# Altium schematic sheet AMU-S18-V00-CURRENTCurrentInterface.SchDoc: Current Sensor Circuity
size A3; DrawnBy: Jonn Dillon; DocumentNumber: 4; SheetNumber: 16; SheetTotal: 25; Project: Shutdown Current Board 2020
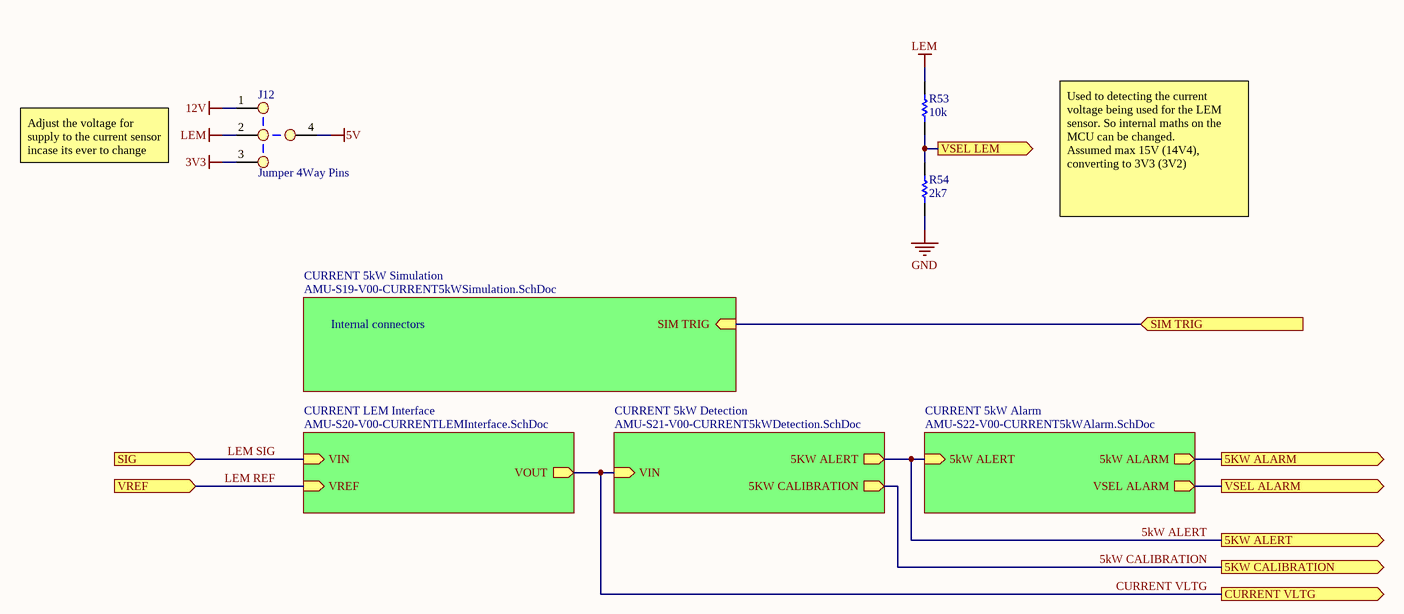
[diagram p0: AMU-S18-V00-CURRENTCurrentInterface.SchDoc]

## Parts
J12  Jumper 4Way Pins  [Jumper_4Way_Pin]
R53  10k  [Res_ThinFilm_0603]
R54  2k7  [Res_ThinFilm_0603]

## Sub-sheets
CURRENT 5kW Alarm = AMU-S22-V00-CURRENT5kWAlarm.SchDoc: 5kW ALARM (out), 5kW ALERT (in), VSEL ALARM (out)
CURRENT 5kW Detection = AMU-S21-V00-CURRENT5kWDetection.SchDoc: VIN (in), 5KW ALERT (out), 5KW CALIBRATION (out)
CURRENT 5kW Simulation = AMU-S19-V00-CURRENT5kWSimulation.SchDoc: SIM TRIG (in)
CURRENT LEM Interface = AMU-S20-V00-CURRENTLEMInterface.SchDoc: VOUT (out), VREF (in), VIN (in)

## Ports
5KW ALARM (out), 5KW ALERT (out), 5KW CALIBRATION (out), CURRENT VLTG (out), SIG (in), SIM TRIG (in), VREF (in), VSEL ALARM (out), VSEL LEM (out)

## Nets
3V3: J12.3
5V: J12.4
12V: J12.1
GND: R54.1
LEM: J12.2 R53.2
5KW ALARM: port 5KW ALARM, sheet CURRENT 5kW Alarm/5kW ALARM
5kW ALERT: port 5KW ALERT, sheet CURRENT 5kW Detection/5KW ALERT, sheet CURRENT 5kW Alarm/5kW ALERT
5kW CALIBRATION: port 5KW CALIBRATION, sheet CURRENT 5kW Detection/5KW CALIBRATION
CURRENT VLTG: port CURRENT VLTG, sheet CURRENT LEM Interface/VOUT, sheet CURRENT 5kW Detection/VIN
LEM REF: port VREF, sheet CURRENT LEM Interface/VREF
LEM SIG: port SIG, sheet CURRENT LEM Interface/VIN
SIM TRIG: port SIM TRIG, sheet CURRENT 5kW Simulation/SIM TRIG
VSEL ALARM: port VSEL ALARM, sheet CURRENT 5kW Alarm/VSEL ALARM
VSEL LEM: R53.1 R54.2 ; port VSEL LEM

## Notes on the sheet
- Adjust the voltage for supply to the current sensor incase its ever to change
- Used to detecting the current voltage being used for the LEM sensor. So internal maths on the MCU can be changed.
  Assumed max 15V (14V4), converting to 3V3 (3V2)
- Internal connectors
- Revision History:
- Sheet Title:
- Rev
- Date
- Description
- Project:
- Size:
- Drawn By:
- A3
- Number:
- Revision:
- Sheet
- Version:
- of
- QUT Motorsport
- O-120, Gardens Point
- 2 George Street
- Brisbane, QLD 4000
- Australia
- Print Date:
- Print Time:
- File Name:

## Library data of the parts
R53 = 10k 5% 0603: Resistor, SMD, 10k, 0.1W, 5%, 0603
R54 = 2k7 5% 0603: Resistor, SMD, 2k7, 0.1W, 5%, 0603